# Altium schematic sheet Sheet2.SchDoc
size A4
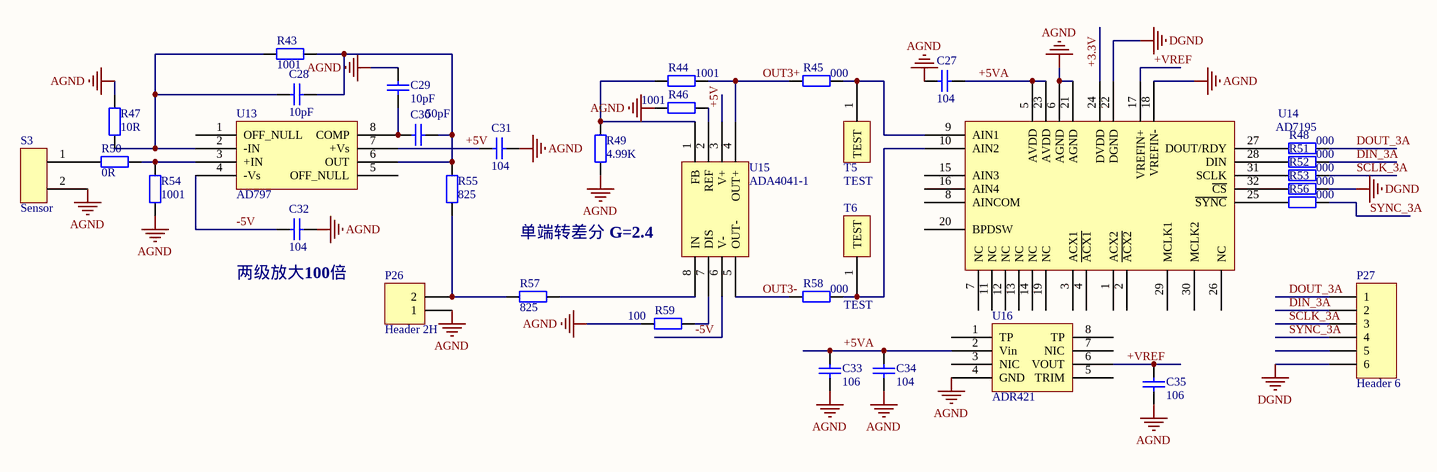
[diagram p0: Sheet2.SchDoc]

## Parts
C27  104  [0805C]
C28  10pF  [0805C]
C29  10pF  [0805C]
C30  50pF  [0805C]
C31  104  [0805C]
C32  104  [0805C]
C33  106  [0805C]
C34  104  [0805C]
C35  106  [0805C]
P26  Header 2H  [HDR1X2]
P27  Header 6  [HDR1X6]
R43  1001  [0805R]  (net tie, no BOM)
R44  1001  [0805R]  (net tie, no BOM)
R45  000  [0805R]  (net tie, no BOM)
R46  1001  [0805R]  (net tie, no BOM)
R47  10R  [0805R]
R48  000  [0805R]  (net tie, no BOM)
R49  4.99K  [0805R]  (net tie, no BOM)
R50  0R  [0805R]
R51  000  [0805R]  (net tie, no BOM)
R52  000  [0805R]  (net tie, no BOM)
R53  000  [0805R]  (net tie, no BOM)
R54  1001  [0805R]  (net tie, no BOM)
R55  825  [0805R]  (net tie, no BOM)
R56  000  [0805R]  (net tie, no BOM)
R57  825  [0805R]  (net tie, no BOM)
R58  000  [0805R]  (net tie, no BOM)
R59  100  [0805R]  (net tie, no BOM)
S3  Sensor  [HDR1X2]
T5  TEST  [TEST]
T6  TEST  [TEST]
U13  AD797  [SO8]
U14  AD7195  [LFCSP32]
U15  ADA4041-1  [SO8]
U16  ADR421  [SO8]

## Nets
AGND: C27.1 C29.2 C31.1 C32.1 C33.2 C34.2 C35.2 P26.1 R46.1 R47.1 R49.1 R54.1 R59.1 S3.2 U14.6(AGND) U14.18(VREFIN-) U14.21(AGND) U16.4(GND)
DGND: P27.6 R53.2 U14.22(DGND)
+3.3V: U14.24(DVDD)
+5V: C31.2 U13.7(+Vs) U15.3(V+)
+5VA: C27.2 C33.1 C34.1 U14.5(AVDD) U14.23(AVDD) U16.2(Vin)
+VREF: C35.1 U14.17(VREFIN+) U16.6(VOUT)
-5V: C32.2 U13.4(-Vs) U15.6(V-)
DIN_3A: P27.2 R51.2
DOUT_3A: P27.1 R48.2
OUT3+: R44.2 R45.1 U15.4(OUT+)
OUT3-: R58.1 U15.5(OUT-)
SCLK_3A: P27.3 R52.2
SYNC_3A: P27.4 R56.2
NetC28_1: C28.1 C30.1 R43.2 R55.2 U13.6(OUT)
NetC28_2: C28.2 R43.1 R47.2 U13.2(-IN)
NetC29_1: C29.1 C30.2 U13.8(COMP)
NetP26_2: P26.2 R55.1 R57.1
NetR44_1: R44.1 R49.2 U15.1(FB)
NetR45_2: R45.2 T5.1(TEST) U14.9(AIN1)
NetR46_2: R46.2 U15.2(REF)
NetR48_1: R48.1 U14.27(DOUT/RDY)
NetR50_1: R50.1 S3.1
NetR50_2: R50.2 R54.2 U13.3(+IN)
NetR51_1: R51.1 U14.28(DIN)
NetR52_1: R52.1 U14.31(SCLK)
NetR53_1: R53.1 U14.32(~{CS})
NetR56_1: R56.1 U14.25(~{SYNC})
NetR57_2: R57.2 U15.8(IN)
NetR58_2: R58.2 T6.1(TEST) U14.10(AIN2)
NetR59_2: R59.2 U15.7(DIS)

Not connected (* = marked no-connect by the designer): P27 5; U13 1(OFF_NULL) 5(OFF_NULL); U14 1(ACX2) 2(~{ACX2}) 3(ACX1) 4(~{ACX1}) 7(NC) 8(AINCOM) 11(NC) 12(NC) 13(NC) 14(NC) 15(AIN3) 16(AIN4) 19(NC) 20(BPDSW) 26(NC) 29(MCLK1) 30(MCLK2); U16 1(TP) 3(NIC) 5(TRIM) 7(NIC) 8(TP)

## Notes on the sheet
- 单端转差分 G=2.4
- (near C32) 两级放大100倍

## Library data of the parts
C27-C35 = Cap: Capacitor; Value: 100nF; Published: 8-Jun-2000; LatestRevisionDate: 17-Jul-2002; LatestRevisionNote: Re-released for DXP Platform.; PackageReference: RAD-0.3; Publisher: Altium Limited
P26 = Header 2H: Header, 2-Pin, Right Angle; LatestRevisionDate: 17-Jul-2002; LatestRevisionNote: Re-released for DXP Platform.; Publisher: Altium Limited
P27 = Header 6: Header, 6-Pin; LatestRevisionDate: 17-Jul-2002; LatestRevisionNote: Re-released for DXP Platform.; Publisher: Altium Limited
R43-R49 R51-R59 = Res2: Resistor; Value: 1K; Published: 8-Jun-2000; LatestRevisionDate: 17-Jul-2002; LatestRevisionNote: Re-released for DXP Platform.; PackageReference: AXIAL-0.4; Publisher: Altium Limited
R50 = Res2: Resistor; Value: 0; Published: 8-Jun-2000; LatestRevisionDate: 17-Jul-2002; LatestRevisionNote: Re-released for DXP Platform.; PackageReference: AXIAL-0.4; Publisher: Altium Limited